# Altium schematic sheet STC12C5A60S2_Core.SchDoc: CPU_Core
size A4
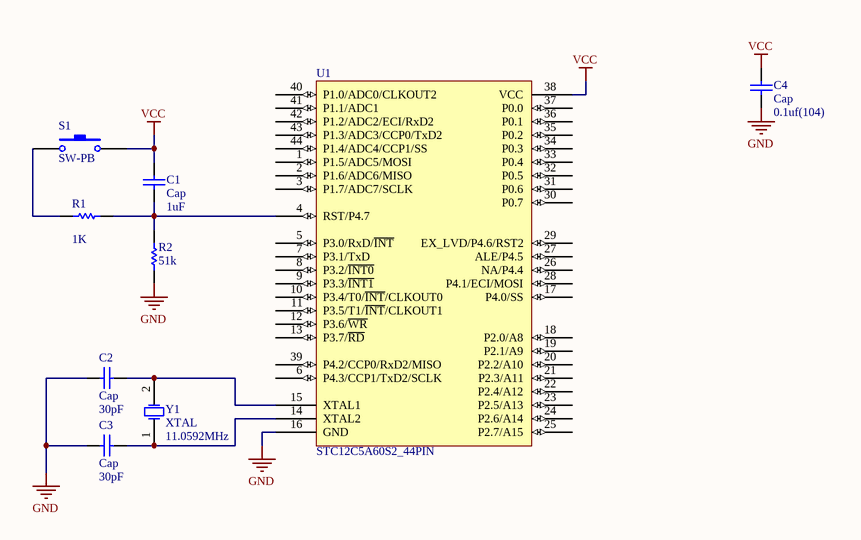
[diagram p0: STC12C5A60S2_Core.SchDoc]

## Parts
C1  Cap  value 1uF  [C0805]
C2  Cap  value 30pF  [C0805]
C3  Cap  value 30pF  [C0805]
C4  Cap  value 0.1uf(104)  [C0805]
R1  value 1K  [R0805]  (hidden comment: Res1)
R2  value 51k  [R0805]  (hidden comment: Res1)
S1  SW-PB  [KEY-DIP4]
U1  STC12C5A60S2_44PIN  [STC12C5A60S2_44PIN]
Y1  XTAL  OscillationFrequency: 11.0592MHz  [XTAL-HC49S-SMD]

## Nets
GND: C2.1 C3.1 C4.1 R2.1 U1.16(GND)
VCC: C1.2 C4.2 S1.2 U1.38(VCC)
NetC1_1: C1.1 R1.2 R2.2 U1.4(RST/P4.7)
NetC2_2: C2.2 U1.15(XTAL1) Y1.2(OSC2)
NetC3_2: C3.2 U1.14(XTAL2) Y1.1(OSC1)
NetR1_1: R1.1 S1.1

Not connected (* = marked no-connect by the designer): U1 1(P1.5/ADC5/MOSI) 2(P1.6/ADC6/MISO) 3(P1.7/ADC7/SCLK) 5(P3.0/RxD/~{INT}) 6(P4.3/CCP1/TxD2/SCLK) 7(P3.1/TxD) 8(P3.2/~{INT0}) 9(P3.3/~{INT1}) 10(P3.4/T0/~{INT}/CLKOUT0) 11(P3.5/T1/~{INT}/CLKOUT1) 12(P3.6/~{WR}) 13(P3.7/~{RD}) 17(P4.0/SS) 18(P2.0/A8) 19(P2.1/A9) 20(P2.2/A10) 21(P2.3/A11) 22(P2.4/A12) 23(P2.5/A13) 24(P2.6/A14) 25(P2.7/A15) 26(NA/P4.4) 27(ALE/P4.5) 28(P4.1/ECI/MOSI) 29(EX_LVD/P4.6/RST2) 30(P0.7) 31(P0.6) 32(P0.5) 33(P0.4) 34(P0.3) 35(P0.2) 36(P0.1) 37(P0.0) 39(P4.2/CCP0/RxD2/MISO) 40(P1.0/ADC0/CLKOUT2) 41(P1.1/ADC1) 42(P1.2/ADC2/ECI/RxD2) 43(P1.3/ADC3/CCP0/TxD2) 44(P1.4/ADC4/CCP1/SS)

## Library data of the parts
C1-C4 = Cap: Non-Polar Capacitor
R1 R2 = Res1: Resistor
S1 = SW-PB: Switch
Y1 = XTAL_1: Crystal Oscillator; 型号: HC49s